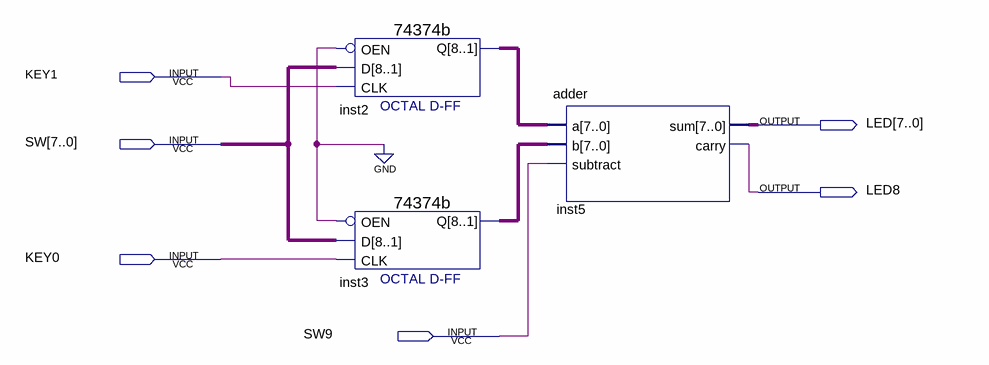
[diagram p0: schematic sheet]
// Quartus schematic Lab2Quartus.bdf as structural Verilog: 3 symbols, 6 pins
module Lab2Quartus (
  input  KEY1,
  input  [7:0] SW,
  input  KEY0,
  input  SW9,
  output [7:0] LED,
  output LED8
);

  wire [7:0] inst2_q, inst3_q;

  \74374b  inst2 (.D(SW), .OEN(1'b0), .CLK(KEY1), .Q(inst2_q));
  \74374b  inst3 (.D(SW), .OEN(1'b0), .CLK(KEY0), .Q(inst3_q));
  adder inst5 (.a(inst2_q), .b(inst3_q), .subtract(SW9), .sum(LED), .carry(LED8));
endmodule
